# Altium schematic sheet ACW.SchDoc
size A4
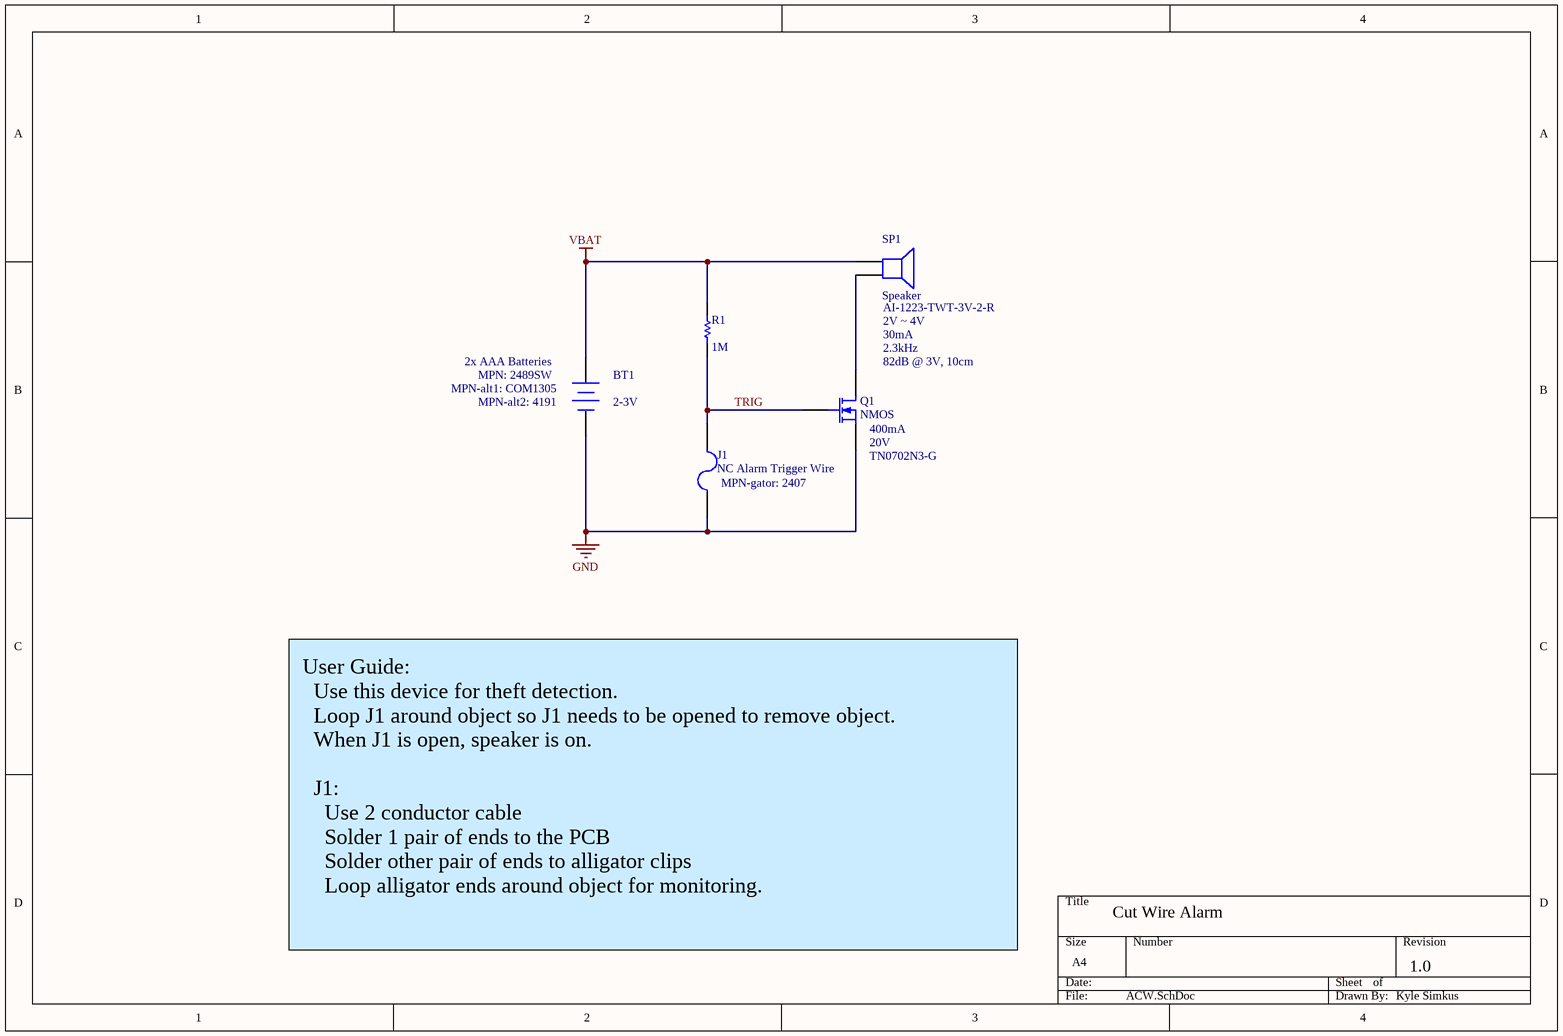
[diagram p0: ACW.SchDoc]

## Parts
BT1  2x AAA Batteries  Voltage: 2-3V  MPN: 2489SW  MPN-alt1: COM1305  MPN-alt2: 4191  [BAT-2]
J1  NC Alarm Trigger Wire  MPN-gator: 2407  [PIN-W2/E2.8]
Q1  NMOS  current: 400mA  Vgs_max: 20V  MPN: TN0702N3-G  [E3]
R1  value 1M  [AXIAL-0.5]  (hidden comment: Res Semi)
SP1  Speaker  MPN: AI-1223-TWT-3V-2-R  Voltage: 2V ~ 4V  current: 30mA  Frequency: 2.3kHz  rating: 82dB @ 3V, 10cm  [SPKR-AI-1223-TWT-3V-2-R]

## Nets
GND: BT1.2(-) J1.1 Q1.3(S)
VBAT: BT1.1(+) R1.2 SP1.1
TRIG: J1.2 Q1.2(G) R1.1
NetQ1_1: Q1.1(D) SP1.2

## Notes on the sheet
- Cut Wire Alarm
- User Guide:
  Use this device for theft detection.
  Loop J1 around object so J1 needs to be opened to remove object.
  When J1 is open, speaker is on.
  J1:
  Use 2 conductor cable
  Solder 1 pair of ends to the PCB
  Solder other pair of ends to alligator clips
  Loop alligator ends around object for monitoring.
- 1.0
- Kyle Simkus

## Library data of the parts
BT1 = Battery: 2x AAA w switch
J1 = Fuse 2
Q1 = MOSFET-N: N-Channel MOSFET; MPN-9V: BS270; MPN-2V: TN0702N3-G
R1 = Res Semi: Semiconductor Resistor
SP1 = Speaker: Loudspeaker